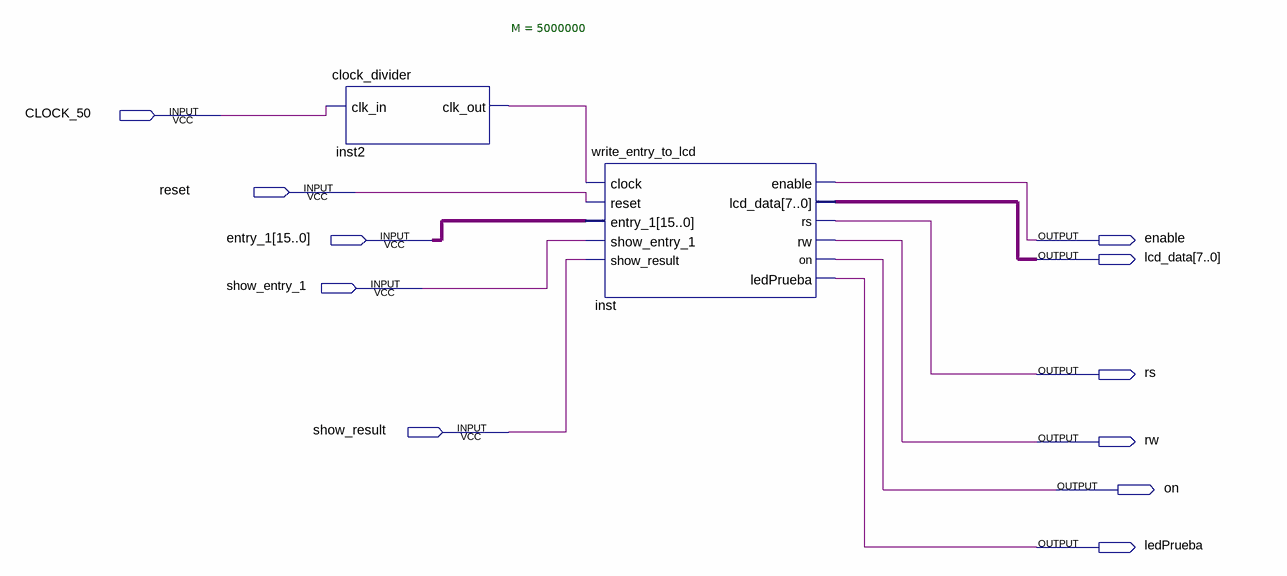
[diagram p0: schematic sheet]
// Quartus schematic lcd_module.bdf as structural Verilog: 2 symbols, 11 pins
module lcd_module (
  input  CLOCK_50,
  input  reset,
  input  [15:0] entry_1,
  input  show_entry_1,
  input  show_result,
  output enable,
  output [7:0] lcd_data,
  output rs,
  output rw,
  output on,
  output ledPrueba
);

  wire inst2_clk_out;

  clock_divider #(.M(5000000)) inst2 (.clk_in(CLOCK_50), .clk_out(inst2_clk_out));
  write_entry_to_lcd inst (
    .clock(inst2_clk_out), .reset(reset), .entry_1(entry_1), .show_entry_1(show_entry_1),
    .show_result(show_result), .enable(enable), .lcd_data(lcd_data), .rs(rs), .rw(rw), .on(on),
    .ledPrueba(ledPrueba));
endmodule
